# EAGLE design IR_daisy_link (EAGLE 5.11)
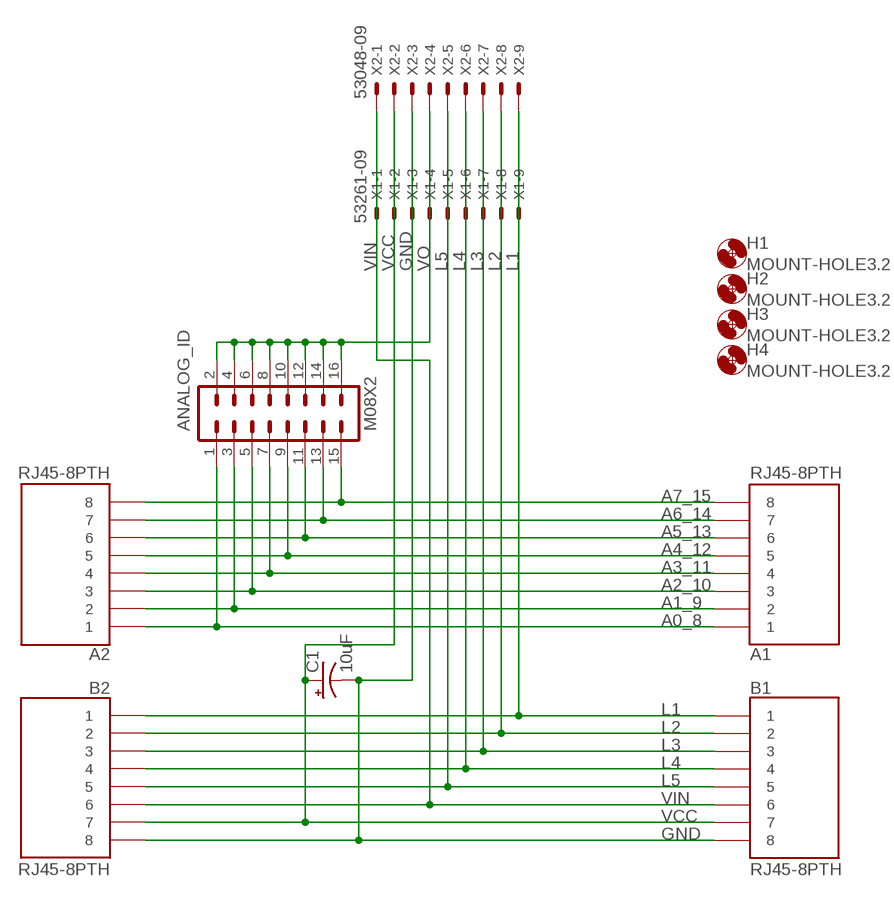
[diagram p0: schematic, sheet 1]

## Parts
A1  RJ45-8PTH  [RJ45-8]
A2  RJ45-8PTH  [RJ45-8]
ANALOG_ID  M08X2  [2X8]
B1  RJ45-8PTH  [RJ45-8]
B2  RJ45-8PTH  [RJ45-8]
C1  10uF  CAP_POLPTH2  [CPOL-RADIAL-10UF-25V]
H1  MOUNT-HOLE3.2  [3,2]
H2  MOUNT-HOLE3.2  [3,2]
H3  MOUNT-HOLE3.2  [3,2]
H4  MOUNT-HOLE3.2  [3,2]
X1  53261-09  [53261-09]
X2  53048-09  [53048-09]

## Nets
A0_8: A1.1 A2.1 ANALOG_ID.1
A1_9: A1.2 A2.2 ANALOG_ID.3
A2_10: A1.3 A2.3 ANALOG_ID.5
A3_11: A1.4 A2.4 ANALOG_ID.7
A4_12: A1.5 A2.5 ANALOG_ID.9
A5_13: A1.6 A2.6 ANALOG_ID.11
A6_14: A1.7 A2.7 ANALOG_ID.13
A7_15: A1.8 A2.8 ANALOG_ID.15
GND: B1.8 B2.8 C1.2(-) X1.3 X2.3
L1: B1.1 B2.1 X1.9 X2.9
L2: B1.2 B2.2 X1.8 X2.8
L3: B1.3 B2.3 X1.7 X2.7
L4: B1.4 B2.4 X1.6 X2.6
L5: B1.5 B2.5 X1.5 X2.5
VCC: B1.7 B2.7 C1.1(+) X1.2 X2.2
VIN: B1.6 B2.6 X1.1 X2.1
VO: ANALOG_ID.2 ANALOG_ID.4 ANALOG_ID.6 ANALOG_ID.8 ANALOG_ID.10 ANALOG_ID.12 ANALOG_ID.14 ANALOG_ID.16 X1.4 X2.4

## Library data of the parts
A1 A2 B1 B2 = SparkFun:RJ45-8: RJ45 Jack Simple RJ45, 8-pin connection - connector for common Cat5, Cat5e, and Cat6 Ethernet cables. Footprint not yet proven in production. Connector sku is PRT-00643; Breakout PCB sku is BOB-00716.
ANALOG_ID = SparkFun:M08X2
C1 = SparkFun:CAP_POL: Capacitor Polarized These are standard SMD and PTH capacitors. Normally 10uF, 47uF, and 100uF in electrolytic and tantalum varieties. Always verify the external diameter of the through hole cap, it varies with capacity, voltage, and manufacturer. The EIA devices should be standard.
H1-H4 = holes:MOUNT-HOLE: MOUNTING HOLE with drill center marker
X1 = con-molex:53?-09: CONNECTOR wire to board 1.25 mm (.049 inch) pitch header; MPN: 53261-0971; OC_FARNELL: 1125362; OC_NEWARK: 93K4249
X2 = con-molex:53?-09: CONNECTOR wire to board 1.25 mm (.049 inch) pitch header; MPN: 53048-0910; OC_FARNELL: 1012239; OC_NEWARK: 98K9837

## Board
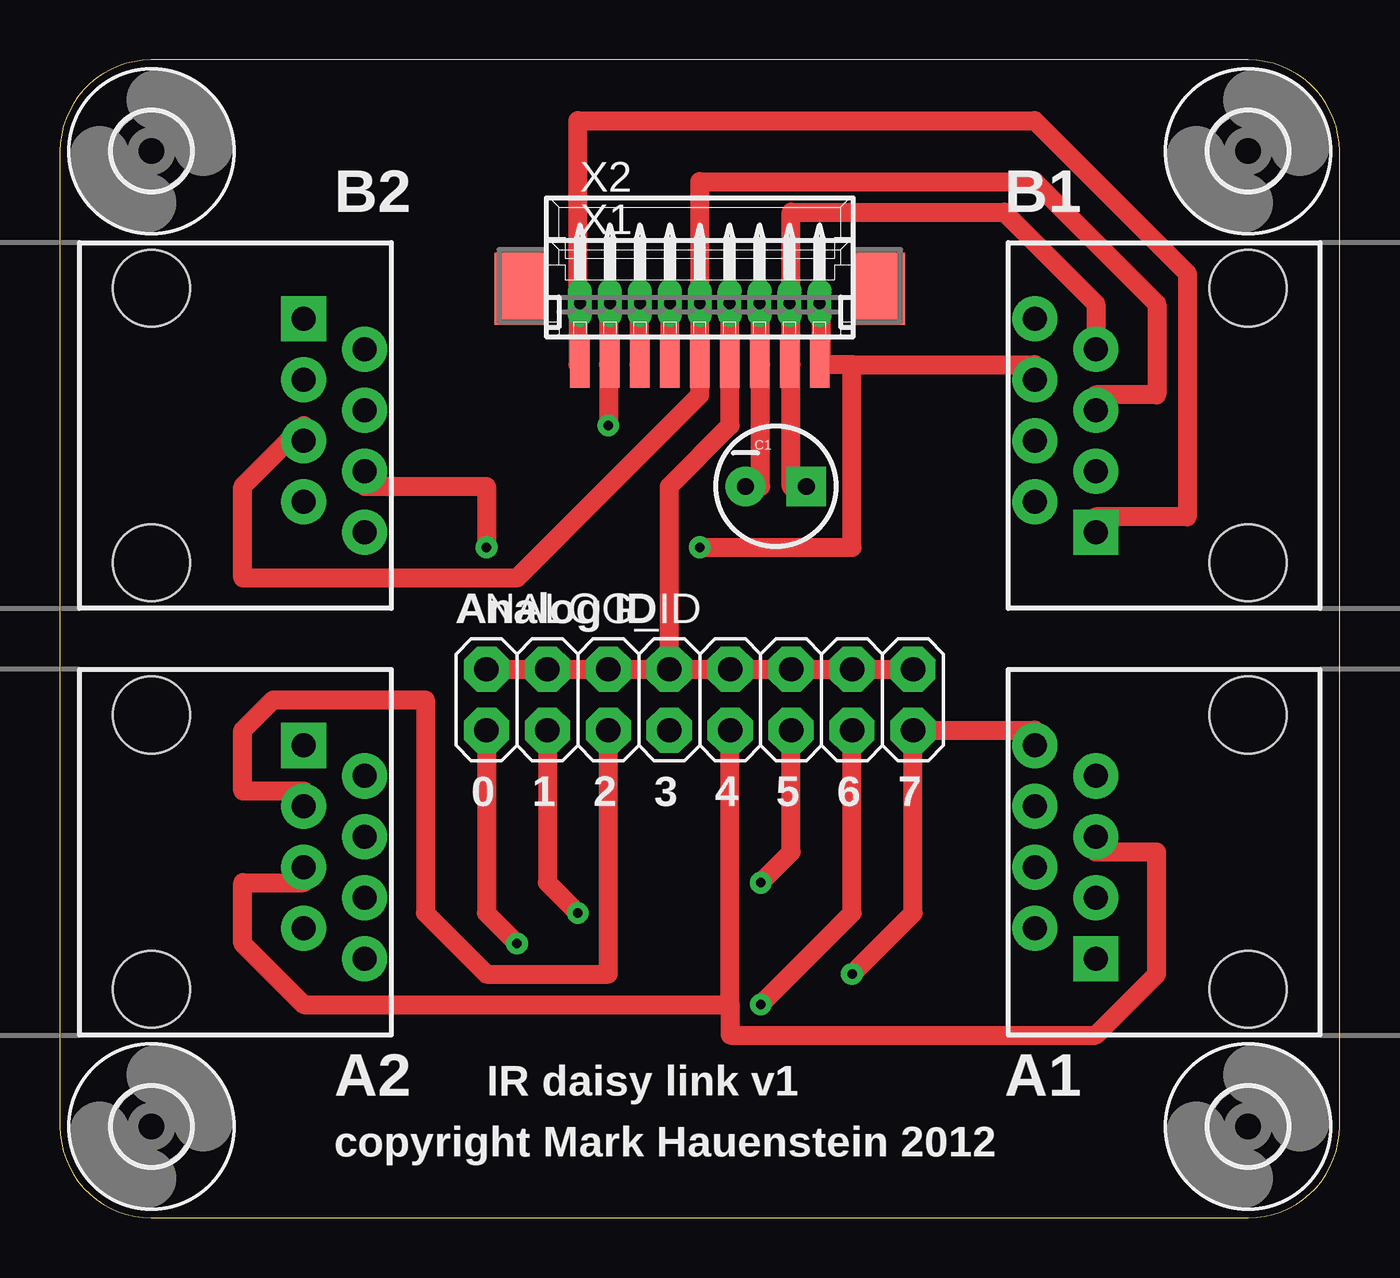
[diagram p1: board, top side]
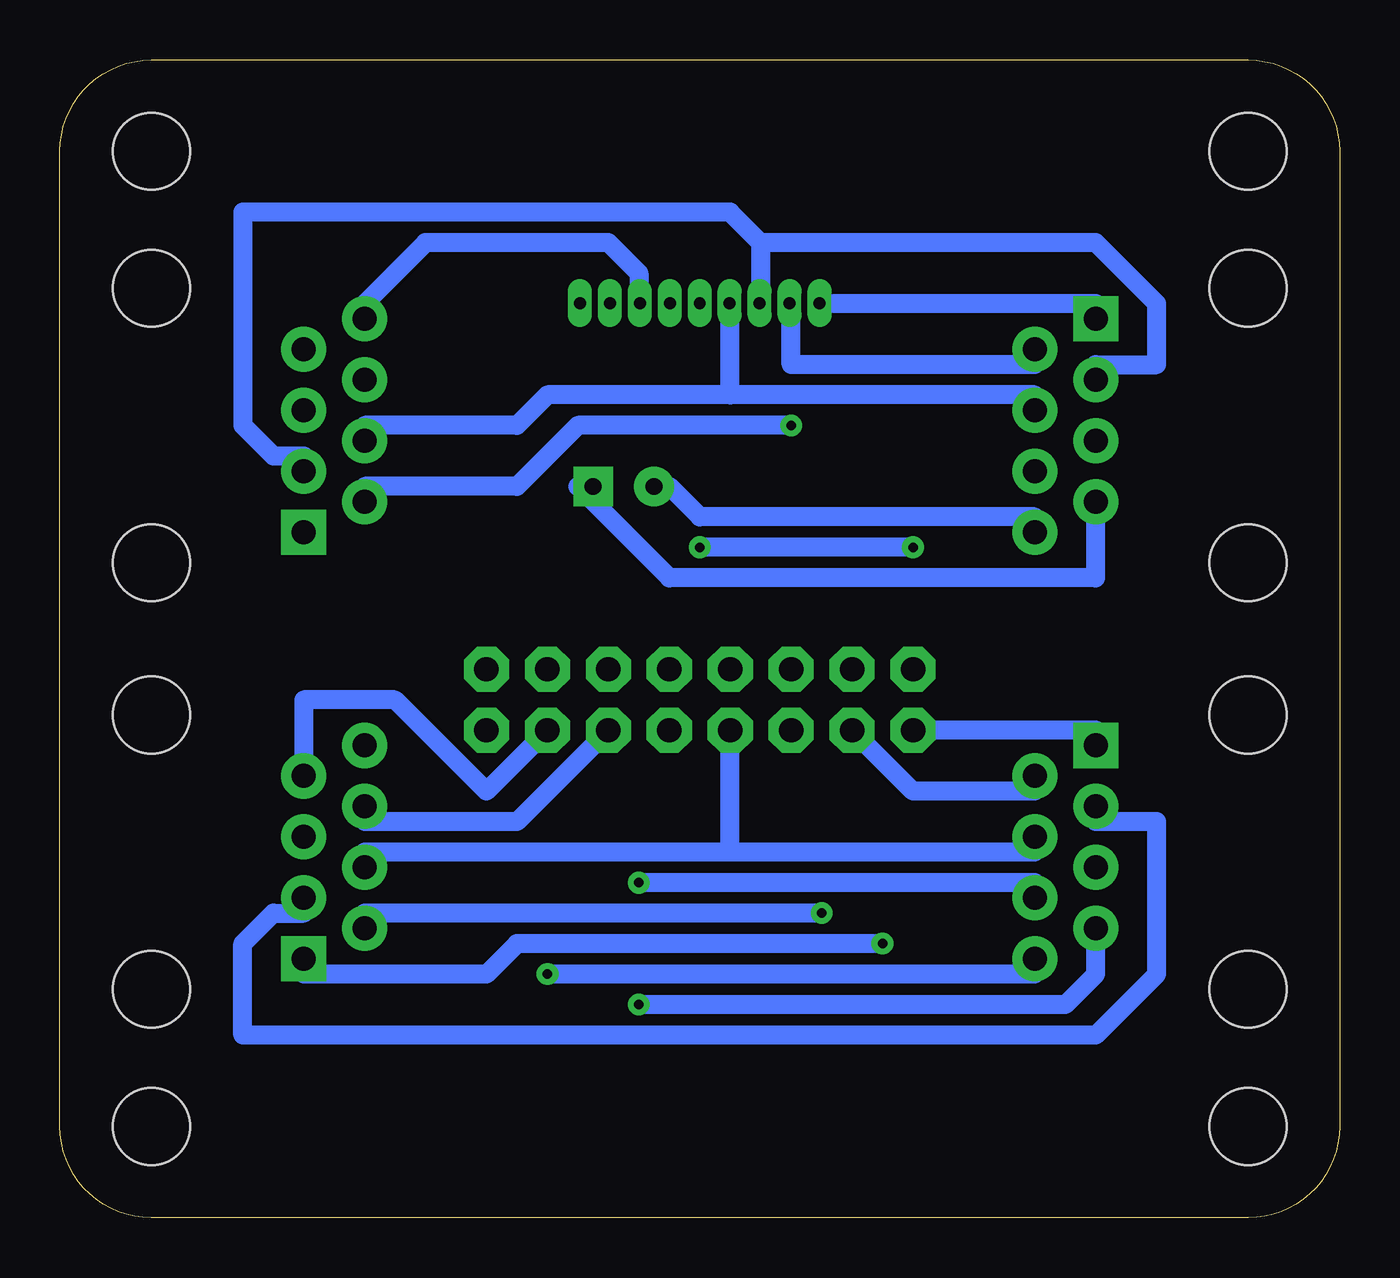
[diagram p2: board, bottom side, seen from below]

Size 53.34 x 48.25 mm. Coordinates in mm from the lower left corner, seen from the top.
Outline: 49.53,0 arc90 53.34,3.81 53.34,44.44 arc90 49.53,48.25 3.81,48.25 arc90 0,44.44 0,3.81 arc90 3.81,0 49.53,0
Copper layers (1*16): Top 0.035mm / dielectric 1.5mm / Bottom 0.035mm
Design rules "pcbtrain *": minimum track width 0.8mm, minimum drill 0.4mm, track to track 0.2mm, track to pad 0.2mm, pad to pad 0.2mm, via to via 0.2mm, smd to smd 0mil, copper to edge 10mil, drill to drill 0.2mm, minimum pad ring 10mil, minimum via ring 10mil, stop-mask expansion 0.125mm, vias tented up to drill 0mil, thermal gap 10mil

### Footprints (pad centres in the part's own frame; a part is rotated, then mirrored left to right if it is on the bottom)
RJ45-8 = drill 1 pad 1.88 square: 1 -4.445,6.35 | drill 1 pad 1.88 round: 2 -3.175,8.89; 3 -1.905,6.35; 4 -0.635,8.89; 5 0.635,6.35; 6 1.905,8.89; 7 3.175,6.35; 8 4.445,8.89 | hole 3.2: -5.715,0; 5.715,0
2X8 = drill 1.016 pad 1.88 octagon: 1 0,0; 2 0,2.54; 3 2.54,0; 4 2.54,2.54; 5 5.08,0; 6 5.08,2.54; 7 7.62,0; 8 7.62,2.54; 9 10.16,0; 10 10.16,2.54; 11 12.7,0; 12 12.7,2.54; 13 15.24,0; 14 15.24,2.54; 15 17.78,0; 16 17.78,2.54
CPOL-RADIAL-10UF-25V = drill 0.7 pad 1.651 square: 1 1.27,0 | drill 0.7 pad 1.651 round: 2 -1.27,0
3,2 = hole 3.2: 0,0
53261-09 = smd 0.8 x 2: 1 5,-2.5; 2 3.75,-2.5; 3 2.5,-2.5; 4 1.25,-2.5; 5 0,-2.5; 6 -1.25,-2.5; 7 -2.5,-2.5; 8 -3.75,-2.5; 9 -5,-2.5 | smd 2.1 x 3: S1 7.5,0.625; S2 -7.5,0.625
53048-09 = drill 0.5 pad 0.698 long: 1 5,-1.25; 2 3.75,-1.25; 3 2.5,-1.25; 4 1.25,-1.25; 5 0,-1.25; 6 -1.25,-1.25; 7 -2.5,-1.25; 8 -3.75,-1.25; 9 -5,-1.25

### Placement (x,y rotation side)
A1  49.53,15.24 90 top
A2  3.81,15.24 270 top
ANALOG_ID  17.78,20.32 0 top
B1  49.53,33.02 90 top
B2  3.81,33.02 270 top
C1  29.84,30.48 0 top
H1  3.81,3.81 0 top
H2  49.53,3.81 0 top
H3  3.81,44.45 0 top
H4  49.53,44.45 0 top
X1  26.67,38.1 0 top
X2  26.67,39.37 0 top

### Tracks (layer width: path | path; a pad name or v marks a point on that pad's centre or on a via)
A0_8  (via drill 0.4)
  Top 0.8: v19.05,11.43 17.78,12.7 ANALOG_ID.1
  Bottom 0.8: ANALOG_ID.1 10.16,20.32 A2.1 | v19.05,11.43 34.29,11.43 35.56,10.16 43.18,10.16 A1.1
A1_9  (via drill 0.4)
  Top 0.8: v21.59,12.7 20.32,13.97 ANALOG_ID.3
  Bottom 0.8: ANALOG_ID.3 17.78,17.78 12.7,17.78 A2.2 | v21.59,12.7 40.64,12.7 A1.2
A2_10
  Top 0.8: ANALOG_ID.5 22.86,10.16 17.78,10.16 15.24,12.7 15.24,21.59 8.89,21.59 7.62,20.32 7.62,17.78 10.16,17.78 A2.3
  Bottom 0.8: A1.3 43.18,12.7 44.45,12.7 45.72,11.43 45.72,7.62 10.16,7.62 7.62,10.16 7.62,16.51 10.16,16.51 A2.3
A3_11
  Bottom 0.8: 25.4,15.24 40.64,15.24 A1.4 | 25.4,15.24 12.7,15.24 A2.4 | 25.4,15.24 ANALOG_ID.7
A4_12
  Top 0.8: 27.94,8.89 10.16,8.89 7.62,11.43 7.62,13.97 10.16,13.97 A2.5 | 27.94,8.89 ANALOG_ID.9 | 27.94,8.89 27.94,7.62 43.18,7.62 45.72,10.16 45.72,15.24 43.18,15.24 A1.5
A5_13  (via drill 0.4)
  Top 0.8: v29.21,13.97 30.48,15.24 ANALOG_ID.11
  Bottom 0.8: v29.21,13.97 12.7,13.97 A2.6 | ANALOG_ID.11 34.29,16.51 40.64,16.51 A1.6
A6_14  (via drill 0.4)
  Top 0.8: v29.21,8.89 33.02,12.7 ANALOG_ID.13
  Bottom 0.8: v29.21,8.89 11.43,8.89 10.16,10.16 A2.7 | ANALOG_ID.13 35.56,17.78 39.37,21.59 43.18,21.59 A1.7
A7_15  (via drill 0.4)
  Top 0.8: v33.02,10.16 35.56,12.7 ANALOG_ID.15 40.64,20.32 A1.8
  Bottom 0.8: v33.02,10.16 12.7,10.16 A2.8
GND
  Top 0.8: 29.21,35.56 29.21,38.1 X2.3 | 29.21,35.56 29.21,30.48 C1.2 | 29.21,35.56 X1.3
  Bottom 0.8: B2.8 12.7,29.21 26.67,29.21 27.94,30.48 C1.2 | B1.8 40.64,38.1 38.1,40.64 30.48,40.64 29.21,39.37 29.21,38.1 X2.3
L1
  Top 0.8: 21.59,38.1 21.59,35.56 X1.9 | 21.59,38.1 21.59,45.72 40.64,45.72 46.99,39.37 46.99,29.21 43.18,29.21 B1.1 | X2.9 21.59,38.1
  Bottom 0.8: X2.9 21.59,38.1 10.16,38.1 B2.1
L2  (via drill 0.4)
  Top 0.8: 22.86,35.56 22.86,38.1 X2.8 | 22.86,35.56 v22.86,33.02 | 22.86,35.56 X1.8
  Bottom 0.8: X2.8 22.86,38.1 22.86,35.56 12.7,35.56 B2.2 | v22.86,33.02 31.75,33.02 34.29,30.48 40.64,30.48 B1.2
L3
  Top 0.8: X1.7 24.13,35.56 24.13,38.1 X2.7
  Bottom 0.8: 24.13,40.64 24.13,38.1 X2.7 | 24.13,40.64 10.16,40.64 7.62,38.1 7.62,35.56 10.16,35.56 B2.3 | 24.13,40.64 25.4,41.91 45.72,41.91 45.72,33.02 44.45,31.75 43.18,31.75 B1.3
L4
  Top 0.8: X1.6 25.4,35.56 25.4,38.1 X2.6
  Bottom 0.8: 25.4,34.29 25.4,38.1 X2.6 | 25.4,34.29 12.7,34.29 B2.4 | 25.4,34.29 33.02,34.29 34.29,33.02 40.64,33.02 B1.4
L5
  Top 0.8: B2.5 10.16,33.02 7.62,30.48 7.62,26.67 19.05,26.67 26.67,34.29 26.67,35.56 X1.5 26.67,38.1 X2.5 26.67,43.18 40.64,43.18 45.72,38.1 45.72,34.29 43.18,34.29 B1.5
VCC
  Top 0.8: 30.48,35.56 30.48,38.1 | 30.48,35.56 30.48,30.48 C1.1 | 30.48,35.56 X1.2 | 30.48,38.1 30.48,41.91 39.37,41.91 43.18,38.1 B1.7 | 30.48,38.1 X2.2
  Bottom 0.8: B2.7 10.16,26.67 27.94,26.67 31.75,30.48 C1.1
VIN  (via drill 0.4)
  Top 0.8: 31.75,35.56 31.75,38.1 X2.1 | 33.02,35.56 40.64,35.56 B1.6 | 33.02,35.56 31.75,35.56 | 31.75,35.56 X1.1 | v17.78,27.94 17.78,30.48 12.7,30.48 B2.6 | v26.67,27.94 33.02,27.94 33.02,35.56
  Bottom 0.8: v17.78,27.94 v26.67,27.94
VO
  Top 0.8: ANALOG_ID.2 ANALOG_ID.4 ANALOG_ID.6 ANALOG_ID.8 | 27.94,35.56 27.94,38.1 X2.4 | 27.94,35.56 27.94,33.02 25.4,30.48 ANALOG_ID.8 | 27.94,35.56 X1.4 | ANALOG_ID.8 ANALOG_ID.10 ANALOG_ID.12 ANALOG_ID.14 ANALOG_ID.16

### Text on the board
tPlace: B2 | B1 | Analog ID | 0 | 1 | 2 | 3 | 4 | 5 | 6 | 7 | A2 | IR daisy link v1 | A1 | copyright Mark Hauenstein 2012